# EAGLE schematic pc2_usb (EAGLE 6.4)
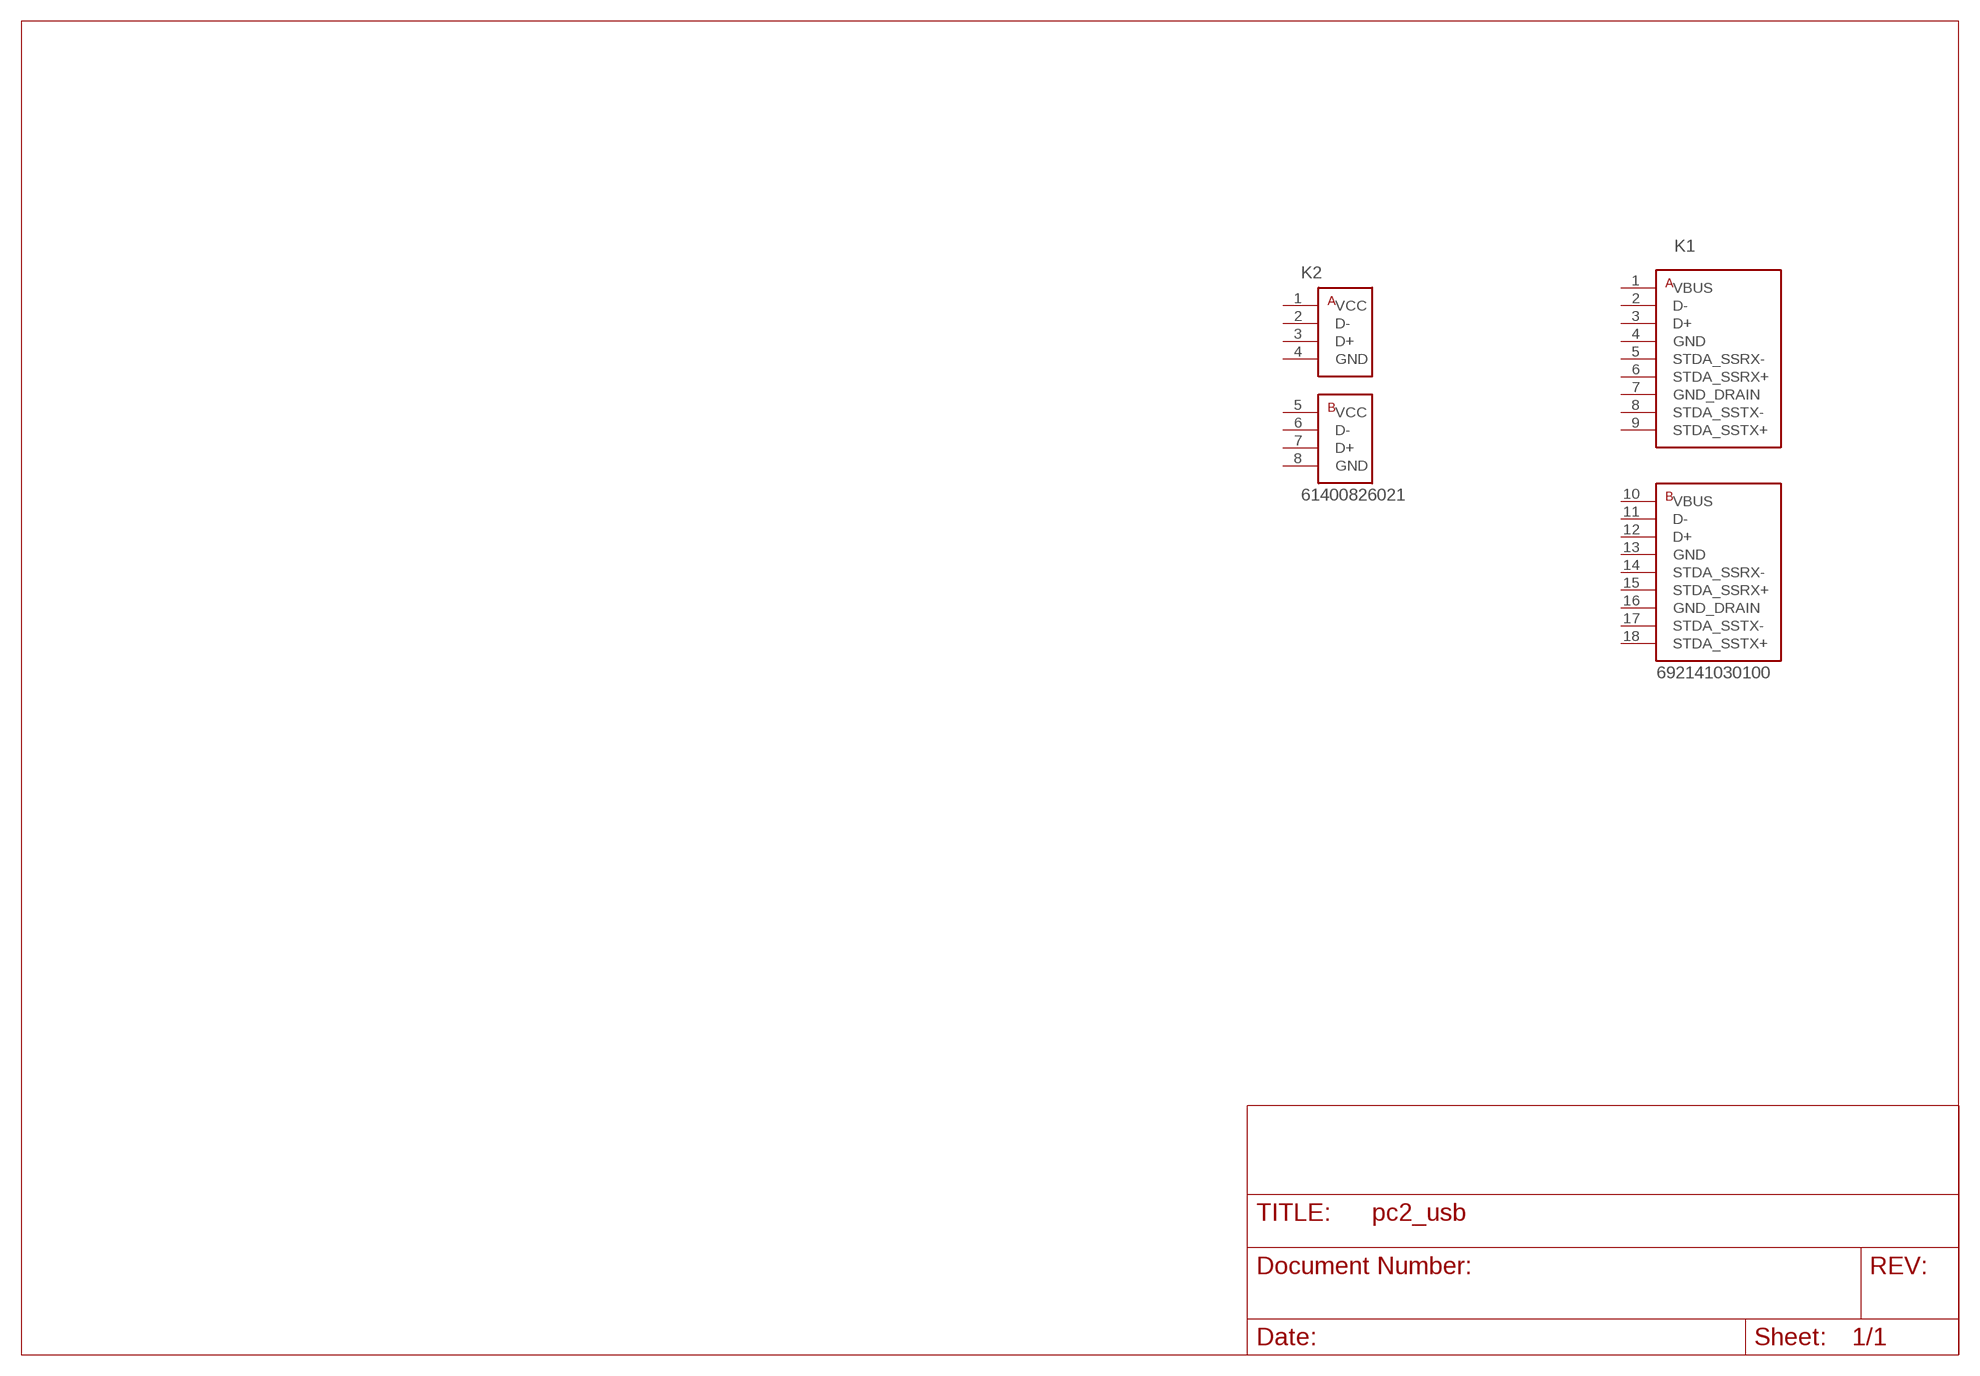
[diagram p0: schematic, sheet 1]

## Parts
K1  692141030100  [692141030100]
K2  61400826021  [61400826021]
Unconnected: K1.1(VBUS) K1.2(D-) K1.3(D+) K1.4(GND) K1.5(STDA_SSRX-) K1.6(STDA_SSRX+) K1.7(GND_DRAIN) K1.8(STDA_SSTX-) K1.9(STDA_SSTX+) K1.10(VBUS) K1.11(D-) K1.12(D+) K1.13(GND) K1.14(STDA_SSRX-) K1.15(STDA_SSRX+) K1.16(GND_DRAIN) K1.17(STDA_SSTX-) K1.18(STDA_SSTX+) K2.1(VCC) K2.2(D-) K2.3(D+) K2.4(GND) K2.5(VCC) K2.6(D-) K2.7(D+) K2.8(GND)

## Library data of the parts
K1 = Wurth_Elektronik_Electromechanic_Input-Output_Connectors_rev15c:692141030100: WR-COM USB 3.0 STACKED TYPE A=>Code : Con_I-O_COM_USB-3.0_A_6921410303100 <http://katalog.we-online.de/media/images/eican/Con_I-O_COM_USB-3.0_A_6921410303100_pf2.jpg> Details see: http://katalog.we-online.de/en/em/692_141_030_100 Created 2014-07-09, Karrer Zheng 2014 (C) Würth Elektronik
K2 = Wurth_Elektronik_Electromechanic_Input-Output_Connectors_rev15c:61400826021: WR-COM Horizontal Dual Stacked USB Type A=>Code : Con_I-O_COM_USB-2.0_A_61400826021 <http://katalog.we-online.de/media/images/eican/Con_I-O_COM_USB-2.0_A_61400826021_pf2.jpg> Details see: http://katalog.we-online.de/en/em/614_008_260_21 Created 2014-07-09, Karrer Zheng 2014 (C) Würth Elektronik